# Altium schematic sheet 3.DEBUG_SD卡_RTC_按键.SchDoc
size 297 x 209 mm; SheetNumber: 3; SheetTotal: 13
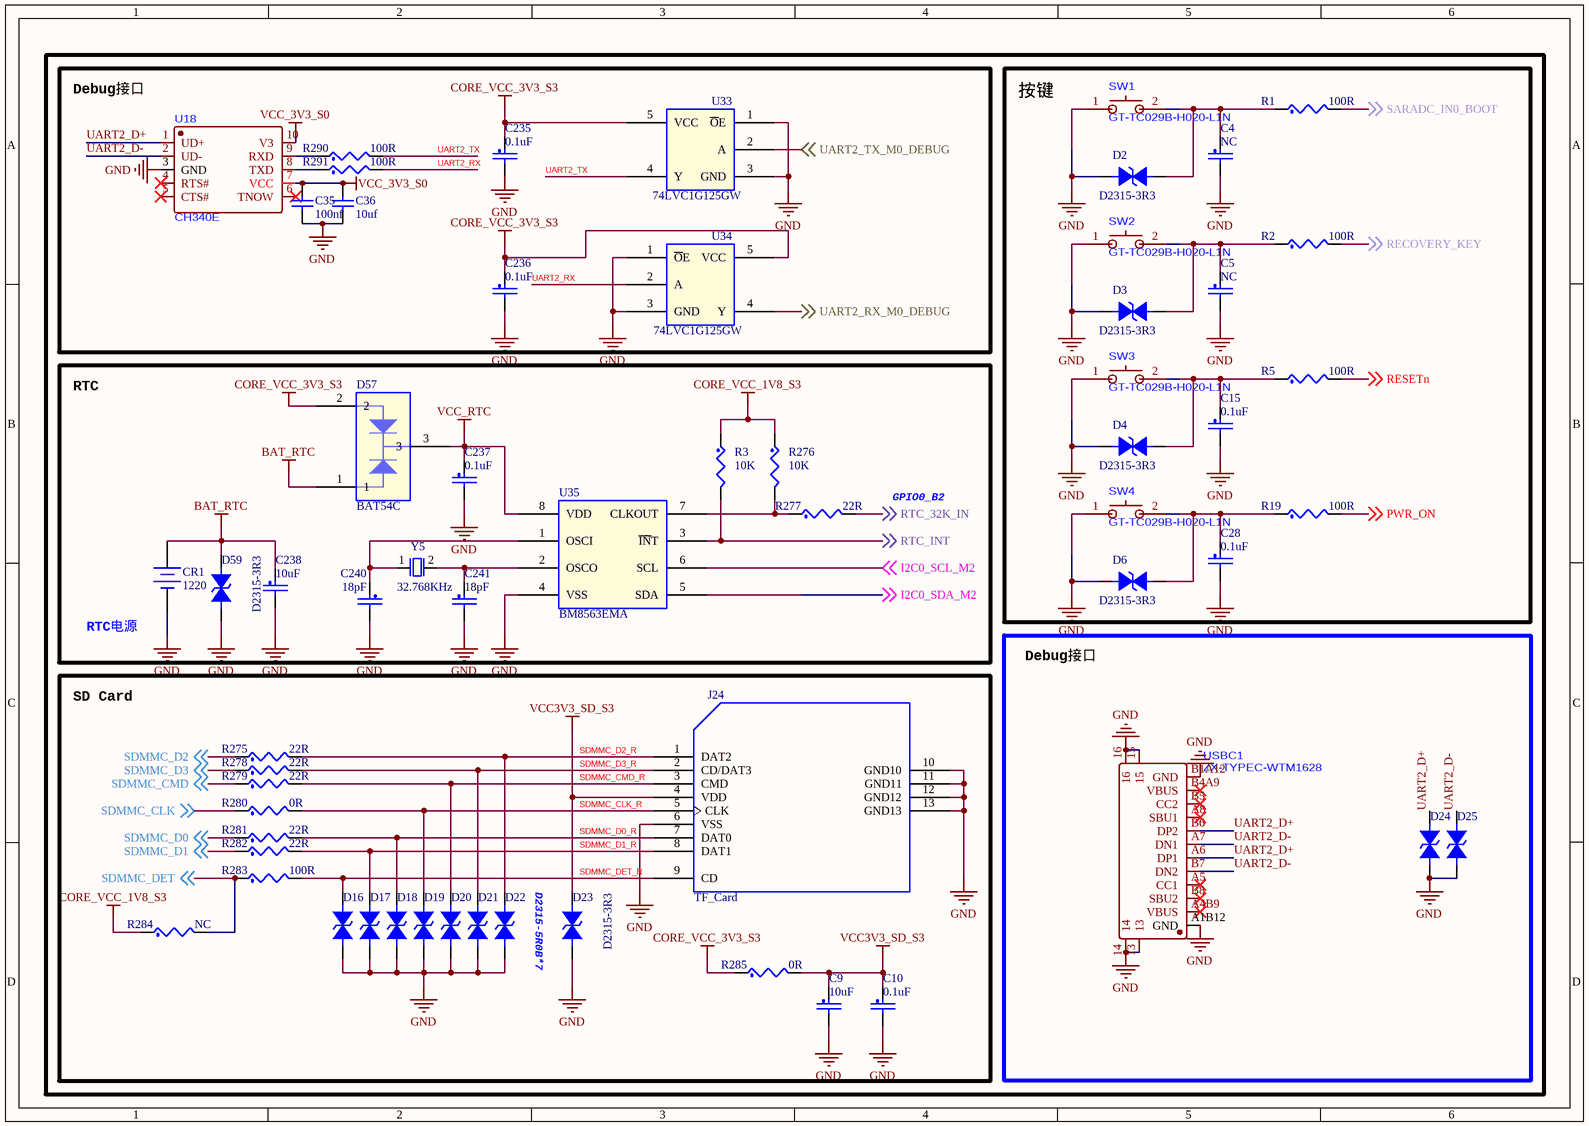
[diagram p0: 3.DEBUG_SD卡_RTC_按键.SchDoc]

## Parts
C4  NC  [C0402]
C5  NC  [C0402]
C9  10uF  [C0402]
C10  0.1uF  [C0402]
C15  0.1uF  [C0402]
C28  0.1uF  [C0402]
C35  100nf  [C0603_L]
C36  10uf  [C0603_L]
C235  0.1uF  [C0402]
C236  0.1uF  [C0402]
C237  0.1uF  [C0402]
C238  10uF  [C0402]
C240  18pF  [C0402]
C241  18pF  [C0402]
CR1  1220  [CR1220_A]
D2  D2315-3R3  [esd0402]
D3  D2315-3R3  [esd0402]
D4  D2315-3R3  [esd0402]
D6  D2315-3R3  [esd0402]
D16  D2315-5R0B  [esd0402]  (value not drawn)
D17  D2315-5R0B  [esd0402]  (value not drawn)
D18  D2315-5R0B  [esd0402]  (value not drawn)
D19  D2315-5R0B  [esd0402]  (value not drawn)
D20  D2315-5R0B  [esd0402]  (value not drawn)
D21  D2315-5R0B  [esd0402]  (value not drawn)
D22  D2315-5R0B  [esd0402]  (value not drawn)
D23  D2315-3R3  [esd0402]
D24  D2315-5R0B  [esd0402]  (value not drawn)
D25  D2315-5R0B  [esd0402]  (value not drawn)
D57  BAT54C  [SOT23]
D59  D2315-3R3  [esd0402]
J24  TF_Card  [TFCARD]
R1  100R  [R0402]
R2  100R  [R0402]
R3  10K  [R0402]
R5  100R  [R0402]
R19  100R  [R0402]
R275  22R  [R0402]
R276  10K  [R0402]
R277  22R  [R0402]
R278  22R  [R0402]
R279  22R  [R0402]
R280  0R  [R0402]
R281  22R  [R0402]
R282  22R  [R0402]
R283  100R  [R0402]
R284  NC  [R0402]
R285  0R  [R0402]
R290  100R  [R0402]
R291  100R  [R0402]
SW1  GT-TC029B-H020-L1N  [SW-SMD_L3.9-W2.9-P4.15-LS5.0]
SW2  GT-TC029B-H020-L1N  [SW-SMD_L3.9-W2.9-P4.15-LS5.0]
SW3  GT-TC029B-H020-L1N  [SW-SMD_L3.9-W2.9-P4.15-LS5.0]
SW4  GT-TC029B-H020-L1N  [SW-SMD_L3.9-W2.9-P4.15-LS5.0]
U18  CH340E  [MSOP-10_L3.0-W3.0-P0.50-LS5.0-BL]
U33  74LVC1G125GW  [SOT-353]
U34  74LVC1G125GW  [SOT-353]
U35  BM8563EMA  [msop-8]
USBC1  ZX-TYPEC-WTM1628  [USB-C-SMD_ZX-TYPEC-WTM1628]
Y5  32.768KHz  [3215]

## Blocks framed on the sheet
Debug接口: C35 C36 C235 C236 R290 R291 U18 U33 U34
按键: C4 C5 C15 C28 D2-D4 D6 R1 R2 R5 R19 SW1-SW4
RTC: C237 C238 C240 C241 CR1 D57 D59 R3 R276 R277 U35 Y5
Debug接口: D24 D25 USBC1
SD Card: C9 C10 D16-D23 J24 R275 R278-R285

## Nets
BAT_RTC: C238.1 CR1.1(DC+) D57.1 D59.1
CORE_VCC_1V8_S3: R3.1 R276.1 R284.1
CORE_VCC_3V3_S3: C235.1 C236.1 D57.2 R285.1 U33.5(VCC) U34.5(VCC)
GND: C4.2 C5.2 C9.2 C10.2 C15.2 C28.2 C35.1 C36.1 C235.2 C236.2 C237.2 C238.2 C240.2 C241.2 CR1.2(DC-) D2.1 D3.1 D4.1 D6.1 D16.1 D17.1 D18.1 D19.1 D20.1 D21.1 D22.1 D23.2 D24.1 D25.1 D59.2 J24.6(VSS) J24.10(GND10) J24.11(GND11) J24.12(GND12) J24.13(GND13) SW1.1 SW2.1 SW3.1 SW4.1 U18.3(GND) U33.1(~{O}E) U33.3(GND) U34.1(~{O}E) U34.3(GND) U35.4(VSS) USBC1.13 USBC1.14 USBC1.15 USBC1.16 USBC1.A1B12(GND) USBC1.B1A12(GND)
VCC3V3_SD_S3: C9.1 C10.1 D23.1 J24.4(VDD) R285.2
VCC_3V3_S0: C35.2 C36.2 U18.7(VCC) U18.10(V3)
VCC_RTC: C237.1 D57.3 U35.8(VDD)
I2C0_SCL_M2: U35.6(SCL) ; off-sheet I2C0_SCL_M2
I2C0_SDA_M2: U35.5(SDA) ; off-sheet I2C0_SDA_M2
PWR_ON: R19.2 ; off-sheet PWR_ON
RECOVERY_KEY: R2.2 ; off-sheet RECOVERY_KEY
RESETn: R5.2 ; off-sheet RESETn
RTC_32K_IN: R277.2 ; off-sheet RTC_32K_IN
RTC_INT: R3.2 U35.3(~{IN}T) ; off-sheet RTC_INT
SARADC_IN0_BOOT: R1.2 ; off-sheet SARADC_IN0_BOOT
SDMMC_CLK: R280.1 ; off-sheet SDMMC_CLK
SDMMC_CLK_R: D19.2 J24.5(CLK) R280.2
SDMMC_CMD: R279.1 ; off-sheet SDMMC_CMD
SDMMC_CMD_R: D20.2 J24.3(CMD) R279.2
SDMMC_D0: R281.1 ; off-sheet SDMMC_D0
SDMMC_D0_R: D18.2 J24.7(DAT0) R281.2
SDMMC_D1: R282.1 ; off-sheet SDMMC_D1
SDMMC_D1_R: D17.2 J24.8(DAT1) R282.2
SDMMC_D2: R275.1 ; off-sheet SDMMC_D2
SDMMC_D2_R: D22.2 J24.1(DAT2) R275.2
SDMMC_D3: R278.1 ; off-sheet SDMMC_D3
SDMMC_D3_R: D21.2 J24.2(CD/DAT3) R278.2
SDMMC_DET: R283.1 R284.2 ; off-sheet SDMMC_DET
SDMMC_DET_R: D16.2 J24.9(CD) R283.2
UART2_D+: D24.2 U18.1(UD+) USBC1.A6(DP1) USBC1.B6(DP2)
UART2_D-: D25.2 U18.2(UD-) USBC1.A7(DN1) USBC1.B7(DN2)
UART2_RX: R291.2 U34.2(A)
UART2_RX_M0_DEBUG: U34.4(Y) ; off-sheet UART2_RX_M0_DEBUG
UART2_TX: R290.2 U33.4(Y)
UART2_TX_M0_DEBUG: U33.2(A) ; off-sheet UART2_TX_M0_DEBUG
NetC4_1: C4.1 D2.2 R1.1 SW1.2
NetC5_1: C5.1 D3.2 R2.1 SW2.2
NetC15_1: C15.1 D4.2 R5.1 SW3.2
NetC28_1: C28.1 D6.2 R19.1 SW4.2
NetC240_1: C240.1 U35.1(OSCI) Y5.1
NetC241_1: C241.1 U35.2(OSCO) Y5.2
NetR276_2: R276.2 R277.1 U35.7(CLKOUT)
NetR290_1: R290.1 U18.9(RXD)
NetR291_1: R291.1 U18.8(TXD)

Not connected (* = marked no-connect by the designer): U18 4(RTS#)* 5(CTS#)* 6(TNOW)*; USBC1 A4B9(VBUS)* A5(CC1)* A8(SBU1)* B4A9(VBUS)* B5(CC2)* B8(SBU2)*

## Notes on the sheet
- (near R277) GPIO0_B2
- RTC电源
- D2315-5R0B*7

## Library data of the parts
C4 C5 C9 C10 C15 C28 C235-C238 C240 C241 = CAP_NP
C35 C36 = C: 贴片电容/MLCC电容
CR1 = BAT_CR1220_CR2032: 微型电池
D2-D4 D6 D16-D25 D59 = DIODE BI-DIR TRIG
R1-R3 R5 R19 R275-R285 R290 R291 = RES
U33 U34 = 74LVC1G125
U35 = HYM8563S
Y5 = CRYSTAL_2P